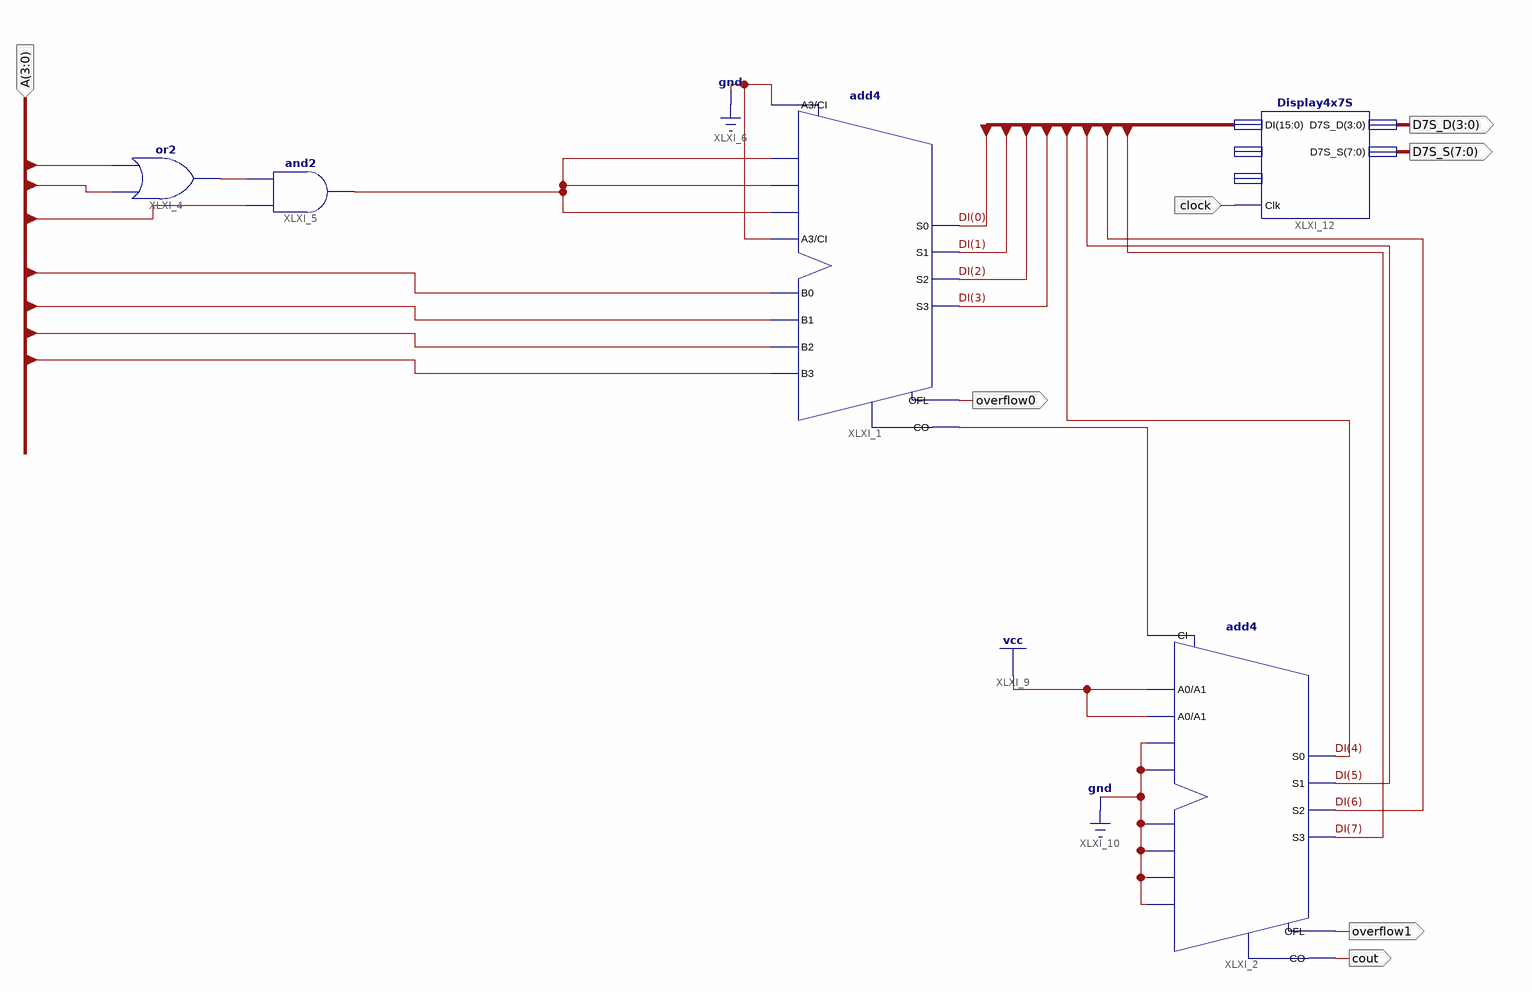
[diagram p0: schematic sheet 1]
// Xilinx ISE schematic sch3.sch (xc9500xl) as structural Verilog: 5 symbols, 7 ports
module sch3 (
  input  [3:0] A,
  input  clock,
  output overflow0,
  output overflow1,
  output cout,
  output [3:0] D7S_D,
  output [7:0] D7S_S
);

  wire XLXN_8, XLXN_10, XLXN_24;
  wire [15:0] DI;

  add4 XLXI_1 (
    .A0(XLXN_10), .A1(XLXN_10), .A2(XLXN_10), .A3(1'b0), .B0(A[0]), .B1(A[1]), .B2(A[2]), .B3(A[3]),
    .CI(1'b0), .CO(XLXN_24), .OFL(overflow0), .S0(DI[0]), .S1(DI[1]), .S2(DI[2]), .S3(DI[3]));
  add4 XLXI_2 (
    .A0(1'b1), .A1(1'b1), .A2(1'b0), .A3(1'b0), .B0(1'b0), .B1(1'b0), .B2(1'b0), .B3(1'b0), .CI(XLXN_24),
    .CO(cout), .OFL(overflow1), .S0(DI[4]), .S1(DI[5]), .S2(DI[6]), .S3(DI[7]));
  or XLXI_4 (XLXN_8, A[2], A[1]);
  and XLXI_5 (XLXN_10, A[3], XLXN_8);
  Display4x7S XLXI_12 (.DI(DI), .D7S_D(D7S_D), .D7S_S(D7S_S), .Clk(clock));  // open: DP, Blank
endmodule
